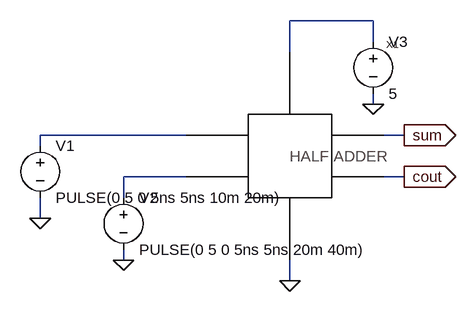
[diagram p0: schematic halfaddertesting.asc]
halfaddertesting.asc, the LTspice schematic file:
Version 4
SHEET 1 880 680
WIRE 320 -48 192 -48
WIRE 320 -16 320 -48
WIRE 192 0 192 -48
WIRE 320 80 320 64
WIRE 32 128 -192 128
WIRE 368 128 336 128
WIRE -192 144 -192 128
WIRE 32 192 -64 192
WIRE 368 192 336 192
WIRE -64 224 -64 192
WIRE -192 256 -192 224
WIRE -64 320 -64 304
WIRE 192 352 192 320
FLAG 192 352 0
FLAG -64 320 0
FLAG -192 256 0
FLAG 320 80 0
FLAG 368 128 sum
IOPIN 368 128 Out
FLAG 368 192 cout
IOPIN 368 192 Out
SYMBOL halfadderimply 176 160 R0
SYMATTR InstName X1
SYMBOL voltage -192 128 R0
WINDOW 123 0 0 Left 0
WINDOW 39 0 0 Left 0
SYMATTR InstName V1
SYMATTR Value PULSE(0 5 0 5ns 5ns 10m 20m)
SYMBOL voltage 320 -32 R0
WINDOW 123 0 0 Left 0
WINDOW 39 0 0 Left 0
SYMATTR InstName V3
SYMATTR Value 5
SYMBOL voltage -64 208 R0
WINDOW 123 0 0 Left 0
WINDOW 39 0 0 Left 0
SYMATTR InstName V2
SYMATTR Value PULSE(0 5 0 5ns 5ns 20m 40m)

The netlist it stands for:
* halfaddertesting.asc
XX1 N002 N003 N001 0 sum cout halfadderimply  ; pins A B VDD VSS SUM COUT
V1 N002 0 PULSE(0 5 0 5ns 5ns 10m 20m)
V3 N001 0 5
V2 N003 0 PULSE(0 5 0 5ns 5ns 20m 40m)
.backanno
.end